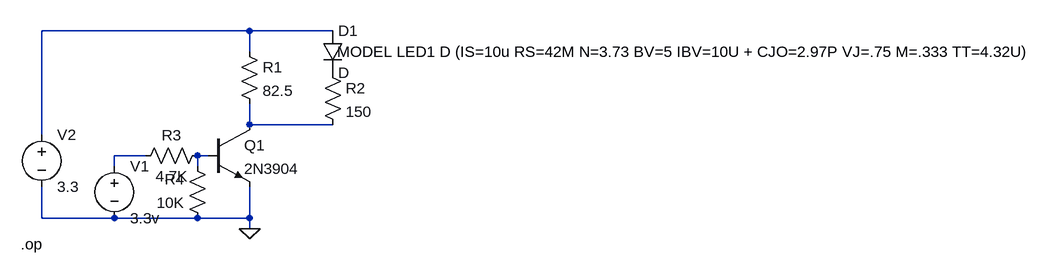
[diagram p0: schematic Draft1.asc]
Draft1.asc, the LTspice schematic file:
Version 4
SHEET 1 1496 680
WIRE 192 -16 -128 -16
WIRE 320 -16 192 -16
WIRE 192 16 192 -16
WIRE 192 128 192 96
WIRE 320 128 192 128
WIRE -128 144 -128 -16
WIRE 32 176 -16 176
WIRE 128 176 112 176
WIRE -16 192 -16 176
WIRE 112 192 112 176
WIRE -128 272 -128 224
WIRE -16 272 -128 272
WIRE 112 272 -16 272
WIRE 192 272 192 224
WIRE 192 272 112 272
WIRE 192 288 192 272
FLAG 192 288 0
SYMBOL res 176 0 R0
SYMATTR InstName R1
SYMATTR Value 82.5
SYMBOL res 304 32 R0
SYMATTR InstName R2
SYMATTR Value 150
SYMBOL diode 304 -16 R0
SYMATTR InstName D1
SYMBOL npn 128 128 R0
SYMATTR InstName Q1
SYMATTR Value 2N3904
SYMBOL voltage -16 176 R0
WINDOW 123 0 0 Left 0
WINDOW 39 0 0 Left 0
SYMATTR InstName V1
SYMATTR Value 3.3v
SYMBOL voltage -128 128 R0
WINDOW 123 0 0 Left 0
WINDOW 39 0 0 Left 0
SYMATTR InstName V2
SYMATTR Value 3.3
SYMBOL res 128 160 R90
WINDOW 0 0 56 VBottom 2
WINDOW 3 32 56 VTop 2
SYMATTR InstName R3
SYMATTR Value 4.7K
SYMBOL res 128 288 R180
WINDOW 0 36 76 Left 2
WINDOW 3 36 40 Left 2
SYMATTR InstName R4
SYMATTR Value 10K
TEXT 320 16 Left 2 !.MODEL LED1 D (IS=10u RS=42M N=3.73 BV=5 IBV=10U + CJO=2.97P VJ=.75 M=.333 TT=4.32U)
TEXT -160 312 Left 2 !.op

The netlist it stands for:
* Draft1.asc
R1 N001 N002 82.5
R2 P001 N002 150
D1 N001 P001 D
Q1 N002 N004 0 0 2N3904
V1 N003 0 3.3v
V2 N001 0 3.3
R3 N004 N003 4.7K
R4 0 N004 10K
.model D D
.lib standard.dio
.model NPN NPN
.model PNP PNP
.lib standard.bjt
.MODEL LED1 D (IS=10u RS=42M N=3.73 BV=5 IBV=10U + CJO=2.97P VJ=.75 M=.333 TT=4.32U)
.op
.backanno
.end